# Altium schematic sheet Sheet1.SchDoc
size A4
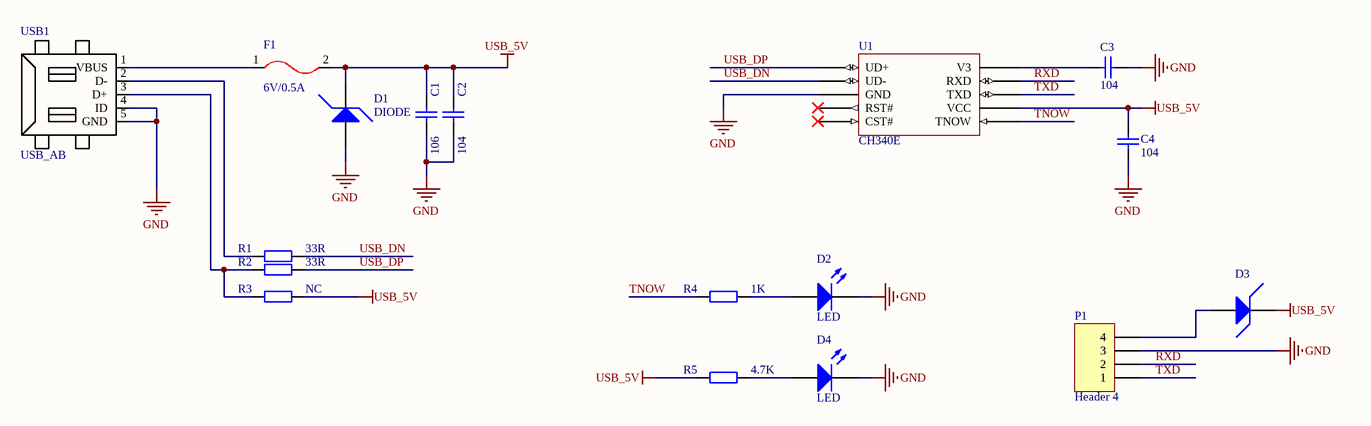
[diagram p0: Sheet1.SchDoc]

## Parts
C1  106  [C_SOP_0603]
C2  104  [C_SOP_0603]
C3  104  [C_SOP_0603]
C4  104  [C_SOP_0603]
D1  DIODE  [SOD-523]
D2  LED  [LED_0603_R]
D3  (no value)  [SOD-523]
D4  LED  [LED_0603_R]
F1  6V/0.5A  [Fuse_0805]
P1  Header 4  [HDR1X4]
R1  33R  [R_SMD_0603]
R2  33R  [R_SMD_0603]
R3  NC  [R_SMD_0603]
R4  1K  [R_SMD_0603]
R5  4.7K  [R_SMD_0603]
U1  CH340E  [MSOP_10]
USB1  USB_AB  [USB_MINI_SMD]

## Nets
GND: C1.1 C2.1 C3.1 C4.2 D1.2(A) D2.2(K) D4.2(K) P1.3 U1.3(GND) USB1.4(ID) USB1.5(GND)
USB_5V: C1.2 C2.2 C4.1 D1.1(K) D3.1(K) F1.2(OUT) R3.2 R5.1 U1.7(VCC)
RXD: P1.2 U1.9(RXD)
TNOW: R4.1 U1.6(TNOW)
TXD: P1.1 U1.8(TXD)
USB_DN: R1.2 U1.2(UD-)
USB_DP: R2.2 U1.1(UD+)
NetC3_2: C3.2 U1.10(V3)
NetD2_1: D2.1(A) R4.2
NetD3_2: D3.2(A) P1.4
NetD4_1: D4.1(A) R5.2
NetF1_1: F1.1(OUT) USB1.1(VBUS)
NetR1_1: R1.1 USB1.2(D-)
NetR2_1: R2.1 R3.1 USB1.3(D+)

Not connected (* = marked no-connect by the designer): U1 4(RST#)* 5(CST#)*

## Library data of the parts
C1-C4 = C_SMD
D3 = DIODE
F1 = FUSE
P1 = Header 4: Header, 4-Pin; LatestRevisionDate: 17-Jul-2002; LatestRevisionNote: Re-released for DXP Platform.; Publisher: Altium Limited
R1-R5 = R_SMD